# Altium project Main_card.PrjPcb
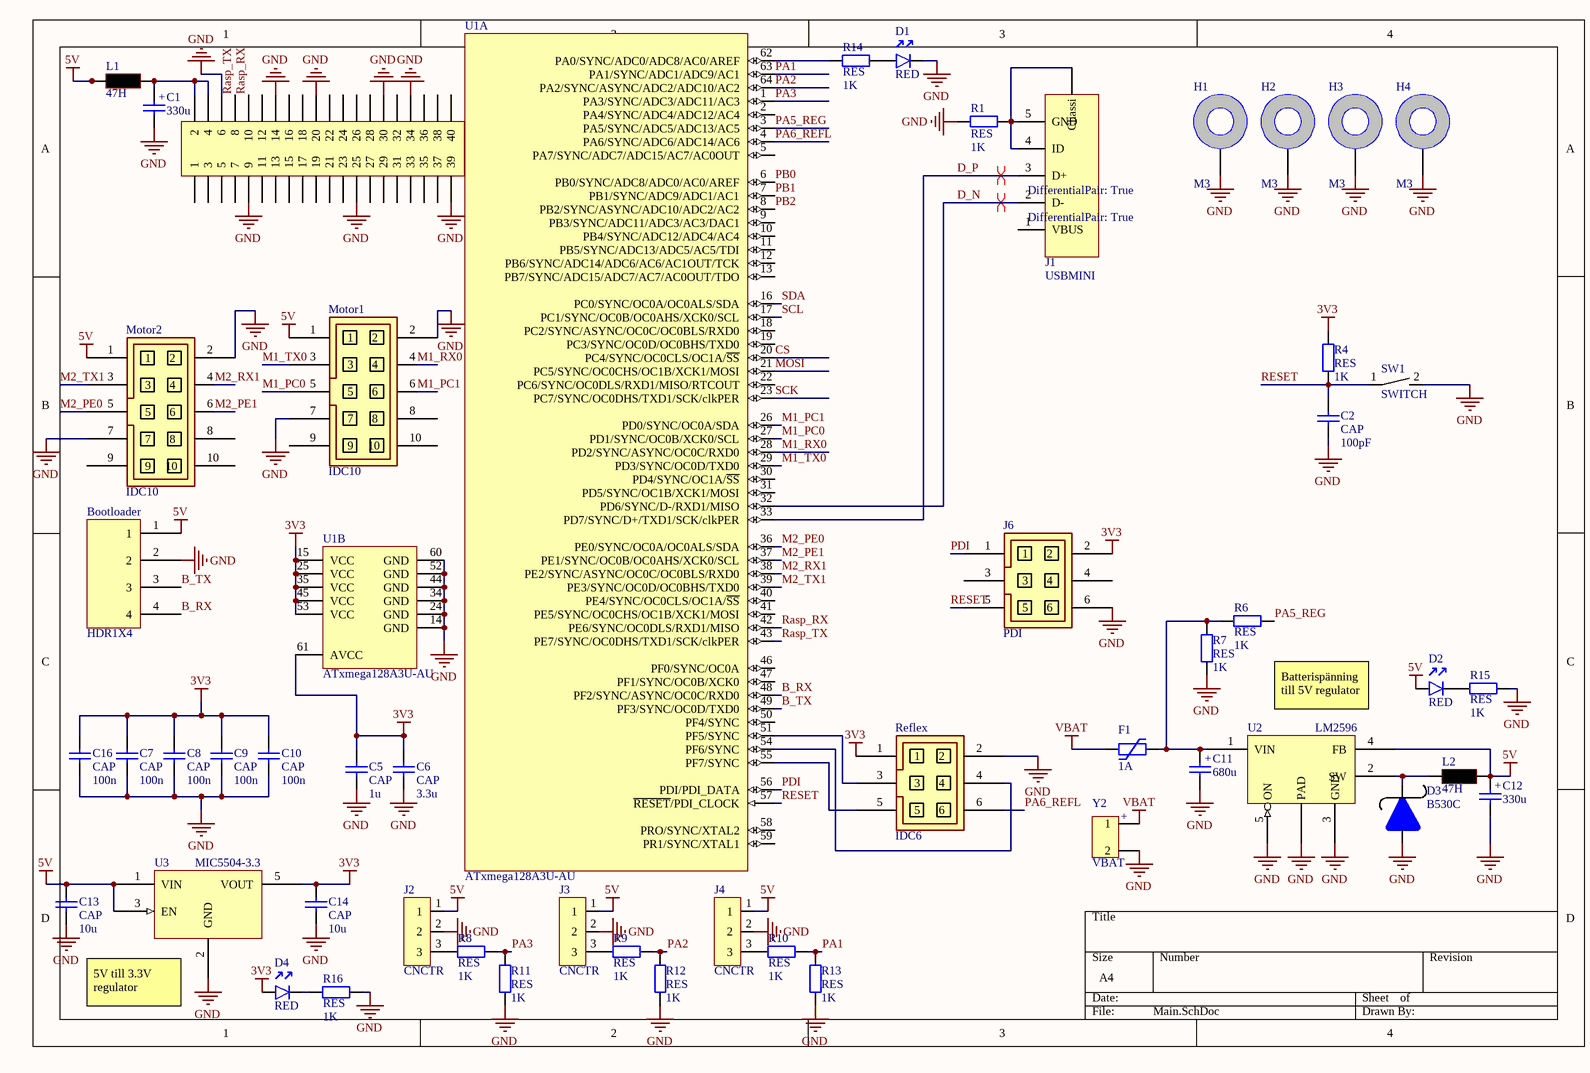
[diagram p0: Main.SchDoc]
2 sheets, 68 parts. Net scope: global (net labels, ports and power ports of the same name join across sheets).
Board file: Main_card.PcbDoc
Sheets:
  Main.SchDoc
  Display.SchDoc

## Sheet Main.SchDoc
size A4

### Parts
Bootloader  HDR1X4  [HEADER_1X4]
C1  330u  [CAP_FAT]
C2  CAP  value 100pF  [CAPC1608X08M]
C5  CAP  value 1u  [CAPC2012X11M]
C6  CAP  value 3.3u  [CAPC2012X11M]
C7  CAP  value 100n  [CAPC1608X08M]
C8  CAP  value 100n  [CAPC1608X08M]
C9  CAP  value 100n  [CAPC1608X08M]
C10  CAP  value 100n  [CAPC1608X08M]
C11  680u  [CAP_FAT]
C12  330u  [CAP_FAT]
C13  CAP  value 10u  [CAPC2012X11M]
C14  CAP  value 10u  [CAPC2012X11M]
C16  CAP  value 100n  [CAPC1608X08M]
D1  RED  [RESC1608X06M]
D2  RED  [RESC1608X06M]
D3  B530C  [Diode_B530C]
D4  RED  [RESC1608X06M]
F1  value 1A  [RESC3216X07M]  (hidden comment: POLYFUSE)
H1  M3  [MOUNT_M3]
H2  M3  [MOUNT_M3]
H3  M3  [MOUNT_M3]
H4  M3  [MOUNT_M3]
J1  USBMINI  [MINI_USB]
J2  CNCTR  [CNCTR_1X3]
J3  CNCTR  [CNCTR_1X3]
J4  CNCTR  [CNCTR_1X3]
J6  PDI  [IDC6]
L1  47H  [DR127]
L2  47H  [DR127]
Motor1  IDC10  [IDC10]
Motor2  IDC10  [IDC10]
R1  RES  value 1K  [RESC1608X06M]
R4  RES  value 1K  [RESC1608X06M]
R6  RES  value 1K  [RESC1608X06M]
R7  RES  value 1K  [RESC1608X06M]
R8  RES  value 1K  [RESC1608X06M]
R9  RES  value 1K  [RESC1608X06M]
R10  RES  value 1K  [RESC1608X06M]
R11  RES  value 1K  [RESC1608X06M]
R12  RES  value 1K  [RESC1608X06M]
R13  RES  value 1K  [RESC1608X06M]
R14  RES  value 1K  [RESC1608X06M]
R15  RES  value 1K  [RESC1608X06M]
R16  RES  value 1K  [RESC1608X06M]
Raspberry_Pi  Header 20X2  [HDR2X20]
Reflex  IDC6  [IDC6]
SW1  SWITCH  [Switch_pad]
U1  ATxmega128A3U-AU  [64A_N]  (parts A,B of 2)
U2  LM2596  [TO263]
U3  MIC5504-3.3  [SOT23-5]
Y2  VBAT  [BAT_CNCTR]

### Nets
3V3: C5.2 C6.2 C7.2 C8.2 C9.2 C10.2 C14.2 C16.2 D4.1(A1) J6.2 R4.2 Reflex.1 U1.15(VCC) U1.25(VCC) U1.35(VCC) U1.45(VCC) U1.53(VCC) U1.61(AVCC) U3.5(VOUT)
5V: Bootloader.1 C12.2 C13.2 D2.1(A1) J2.1 J3.1 J4.1 L1.1 L2.2 Motor1.1 Motor2.1 U2.4(FB) U3.1(VIN) U3.3(EN)
GND: Bootloader.2 C1.1 C2.1 C5.1 C6.1 C7.1 C8.1 C9.1 C10.1 C11.1 C12.1 C13.1 C14.1 C16.1 D1.2(K) D3.1 H1.1 H2.1 H3.1 H4.1 J2.2 J3.2 J4.2 J6.6 Motor1.2 Motor1.7 Motor2.2 Motor2.7 R1.1 R7.2 R11.1 R12.1 R13.1 R15.1 R16.1 Raspberry_Pi.6 Raspberry_Pi.9 Raspberry_Pi.14 Raspberry_Pi.20 Raspberry_Pi.25 Raspberry_Pi.30 Raspberry_Pi.34 Raspberry_Pi.39 Reflex.2 SW1.2 U1.14(GND) U1.24(GND) U1.34(GND) U1.44(GND) U1.52(GND) U1.60(GND) U2.3(GND) U2.5(ON) U2.PAD U3.2(GND) Y2.2
VBAT: F1.1 Y2.1
B_RX: Bootloader.4 U1.48(PF2/SYNC/ASYNC/OC0C/RXD0)
B_TX: Bootloader.3 U1.49(PF3/SYNC/OC0D/TXD0)
CS: U1.20(PC4/SYNC/OC0CLS/OC1A/~{SS})
D_N: J1.2(D-) U1.32(PD6/SYNC/D-/RXD1/MISO)
D_P: J1.3(D+) U1.33(PD7/SYNC/D+/TXD1/SCK/clkPER)
M1_PC0: Motor1.5 U1.27(PD1/SYNC/OC0B/XCK0/SCL)
M1_PC1: Motor1.6 U1.26(PD0/SYNC/OC0A/SDA)
M1_RX0: Motor1.4 U1.28(PD2/SYNC/ASYNC/OC0C/RXD0)
M1_TX0: Motor1.3 U1.29(PD3/SYNC/OC0D/TXD0)
M2_PE0: Motor2.5 U1.36(PE0/SYNC/OC0A/OC0ALS/SDA)
M2_PE1: Motor2.6 U1.37(PE1/SYNC/OC0B/OC0AHS/XCK0/SCL)
M2_RX1: Motor2.4 U1.38(PE2/SYNC/ASYNC/OC0C/OC0BLS/RXD0)
M2_TX1: Motor2.3 U1.39(PE3/SYNC/OC0D/OC0BHS/TXD0)
MOSI: U1.21(PC5/SYNC/OC0CHS/OC1B/XCK1/MOSI)
PA1: R10.1 R13.2 U1.63(PA1/SYNC/ADC1/ADC9/AC1)
PA2: R9.1 R12.2 U1.64(PA2/SYNC/ASYNC/ADC2/ADC10/AC2)
PA3: R8.1 R11.2 U1.1(PA3/SYNC/ADC3/ADC11/AC3)
PA5_REG: R6.1 U1.3(PA5/SYNC/ADC5/ADC13/AC5)
PA6_REFL: Reflex.6 U1.4(PA6/SYNC/ADC6/ADC14/AC6)
PB0: U1.6(PB0/SYNC/ADC8/ADC0/AC0/AREF)
PB1: U1.7(PB1/SYNC/ADC9/ADC1/AC1)
PB2: U1.8(PB2/SYNC/ASYNC/ADC10/ADC2/AC2)
PDI: J6.1 U1.56(PDI/PDI_DATA)
Rasp_RX: Raspberry_Pi.10 U1.42(PE6/SYNC/OC0DLS/RXD1/MISO)
Rasp_TX: Raspberry_Pi.8 U1.43(PE7/SYNC/OC0DHS/TXD1/SCK/clkPER)
RESET: C2.2 J6.5 R4.1 SW1.1 U1.57(~{RESET}/PDI_CLOCK)
SCK: U1.23(PC7/SYNC/OC0DHS/TXD1/SCK/clkPER)
SCL: U1.17(PC1/SYNC/OC0B/OC0AHS/XCK0/SCL)
SDA: U1.16(PC0/SYNC/OC0A/OC0ALS/SDA)
NetC1_2: C1.2 L1.2 Raspberry_Pi.2 Raspberry_Pi.4
NetC11_2: C11.2 F1.2 R6.2 R7.1 U2.1(VIN)
NetD1_1: D1.1(A1) R14.2
NetD2_2: D2.2(K) R15.2
NetD3_2: D3.2 L2.1 U2.2(SW)
NetD4_2: D4.2(K) R16.2
NetJ1_4: J1.4(ID) J1.5(GND) J1.C(Chassi) R1.2
NetJ2_3: J2.3 R8.2
NetJ3_3: J3.3 R9.2
NetJ4_3: J4.3 R10.2
NetR14_1: R14.1 U1.62(PA0/SYNC/ADC0/ADC8/AC0/AREF)
NetReflex_3: Reflex.3 U1.51(PF5/SYNC)
NetReflex_4: Reflex.4 U1.54(PF6/SYNC)
NetReflex_5: Reflex.5 U1.55(PF7/SYNC)

Not connected (* = marked no-connect by the designer): J1 1(VBUS); J6 3 4; Motor1 8 9 10; Motor2 8 9 10; Raspberry_Pi 1 3 5 7 11 12 13 15 16 17 18 19 21 22 23 24 26 27 28 29 31 32 33 35 36 37 38 40; U1 2(PA4/SYNC/ADC4/ADC12/AC4) 5(PA7/SYNC/ADC7/ADC15/AC7/AC0OUT) 9(PB3/SYNC/ADC11/ADC3/AC3/DAC1) 10(PB4/SYNC/ADC12/ADC4/AC4) 11(PB5/SYNC/ADC13/ADC5/AC5/TDI) 12(PB6/SYNC/ADC14/ADC6/AC6/AC1OUT/TCK) 13(PB7/SYNC/ADC15/ADC7/AC7/AC0OUT/TDO) 18(PC2/SYNC/ASYNC/OC0C/OC0BLS/RXD0) 19(PC3/SYNC/OC0D/OC0BHS/TXD0) 22(PC6/SYNC/OC0DLS/RXD1/MISO/RTCOUT) 30(PD4/SYNC/OC1A/~{SS}) 31(PD5/SYNC/OC1B/XCK1/MOSI) 40(PE4/SYNC/OC0CLS/OC1A/~{SS}) 41(PE5/SYNC/OC0CHS/OC1B/XCK1/MOSI) 46(PF0/SYNC/OC0A) 47(PF1/SYNC/OC0B/XCK0) 50(PF4/SYNC) 58(PRO/SYNC/XTAL2) 59(PR1/SYNC/XTAL1)

### Layout directives
differential pair: D_N, D_P

### Notes on the sheet
- Batterispänning till 5V regulator
- (near U3) 5V till 3.3V regulator
- (in symbol BAT_CNCTR) +
- (in symbol POLCAP) +

### Library data of the parts
Bootloader = HDR1X4: 4pin header
C1 C11 C12 = POLCAP
C2 C5-C10 C13 C14 C16 = CAP: Capacitor; Published: 8-Jun-2000; LatestRevisionDate: 17-Jul-2002; LatestRevisionNote: Re-released for DXP Platform.; PackageReference: RB7.6-15; Publisher: Altium Limited; PackageDescription: Polarized Capacitor (Radial); 2 Leads
D1 D2 D4 = LED
D3 = Diode_B530C
H1-H4 = MOUNT_M3
J1 = MINI_USB
J2-J4 = Connector: 3pin connector
J6 Reflex = IDC6: 6pin IDC connector
L1 L2 = DR127
Motor1 Motor2 = IDC10: 10pin IDC connector
R1 R4 R6-R16 = RES: Resistor; Published: 8-Jun-2000; LatestRevisionDate: 17-Jul-2002; LatestRevisionNote: Re-released for DXP Platform.; PackageReference: AXIAL-0.4; Publisher: Altium Limited; PackageDescription: Axial Device, Thru-Hole; 2 Leads; 0.4 in Pin Spacing
Raspberry_Pi = Header 20X2: Header, 20-Pin, Dual row; LatestRevisionDate: 17-Jul-2002; LatestRevisionNote: Re-released for DXP Platform.; Publisher: Altium Limited
U1 = ATxmega128A3U-AU: 8/16-bit AVR XMEGA A4 Microcontroller, 1.6-3.6V, 32MHz, 128K + 8KB Flash, 2K EEPROM, 8K SRAM, 64-pin TQFP, Industrial Grade (-40°C to 85°C); DatasheetVersion: revB, Dec-2011; PackageVersion: revC, Oct-2010; PackageReference: 64A; PackageDescription: 64-Pin Plastic Thin Profile Quad Flat Pack, 14 x 14 x 1.0 mm Body, 0.8 mm Pitch (TQFP); Code_JEDEC: MS-026-AEB; ComponentLink1Description: Manufacturer URL; ComponentLink1URL: http://www.atmel.com/; ComponentLink2Description: ATxmega64A3U/128A3U/192A3U/256A3U Datasheet; ComponentLink2URL: http://www.atmel.com/dyn/resources/prod_documents/doc8386.pdf
Y2 = BAT_CNCTR: 2-pin batteri kontakt
F1 = POLYFUSE: Published: 8-Jun-2000; LatestRevisionDate: 17-Jul-2002; LatestRevisionNote: Re-released for DXP Platform.; PackageReference: AXIAL-0.4; Publisher: Altium Limited; PackageDescription: Axial Device, Thru-Hole; 2 Leads; 0.4 in Pin Spacing

## Sheet Display.SchDoc
size A4
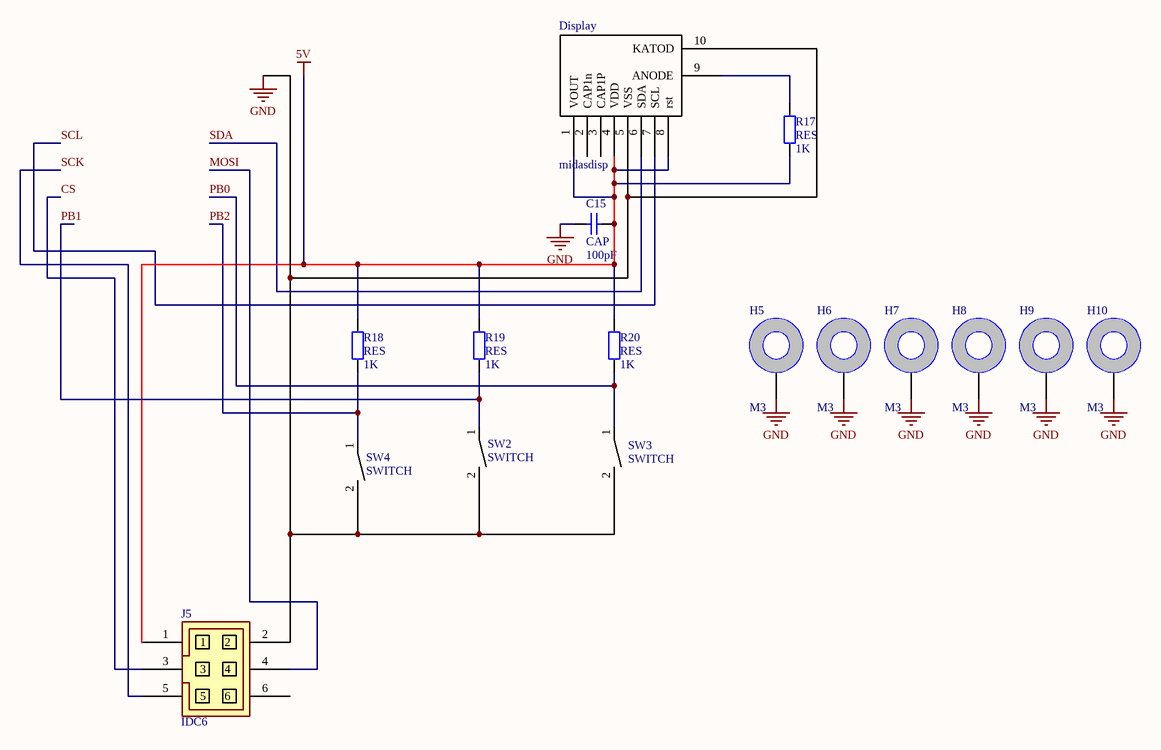
[diagram p1: Display.SchDoc]

### Parts
C15  CAP  value 100pF  [CAPC1608X08M]
Display  midasdisp  [Display]
H5  M3  [MOUNT_M3]
H6  M3  [MOUNT_M3]
H7  M3  [MOUNT_M3]
H8  M3  [MOUNT_M3]
H9  M3  [MOUNT_M3]
H10  M3  [MOUNT_M3]
J5  IDC6  [IDC6]
R17  RES  value 1K  [RESC1608X06M]
R18  RES  value 1K  [RESC1608X06M]
R19  RES  value 1K  [RESC1608X06M]
R20  RES  value 1K  [RESC1608X06M]
SW2  SWITCH  [Switch_pad]
SW3  SWITCH  [Switch_pad]
SW4  SWITCH  [Switch_pad]

### Nets
5V: C15.2 Display.1(VOUT) Display.4(VDD) Display.8(rst) J5.1 R17.1 R18.2 R19.2 R20.2
GND: C15.1 Display.5(VSS) Display.10(KATOD) H5.1 H6.1 H7.1 H8.1 H9.1 H10.1 J5.2 SW2.2 SW3.2 SW4.2
CS: J5.3
MOSI: J5.4
PB0: R20.1 SW3.1
PB1: R19.1 SW2.1
PB2: R18.1 SW4.1
SCK: J5.5
SCL: Display.7(SCL)
SDA: Display.6(SDA)
NetDisplay_9: Display.9(ANODE) R17.2

Not connected (* = marked no-connect by the designer): Display 2(CAP1n) 3(CAP1P); J5 6

### Library data of the parts
C15 = CAP: Capacitor; Published: 8-Jun-2000; LatestRevisionDate: 17-Jul-2002; LatestRevisionNote: Re-released for DXP Platform.; PackageReference: RB7.6-15; Publisher: Altium Limited; PackageDescription: Polarized Capacitor (Radial); 2 Leads
H5-H10 = MOUNT_M3
J5 = IDC6: 6pin IDC connector
R17-R20 = RES: Resistor; Published: 8-Jun-2000; LatestRevisionDate: 17-Jul-2002; LatestRevisionNote: Re-released for DXP Platform.; PackageReference: AXIAL-0.4; Publisher: Altium Limited; PackageDescription: Axial Device, Thru-Hole; 2 Leads; 0.4 in Pin Spacing

## Nets that join several sheets
5V: Main (14 pins), Display (9 pins)
GND: Main (56 pins), Display (13 pins)
CS: Main (U1.20), Display (J5.3)
MOSI: Main (U1.21), Display (J5.4)
PB0: Main (U1.6), Display (R20.1 SW3.1)
PB1: Main (U1.7), Display (R19.1 SW2.1)
PB2: Main (U1.8), Display (R18.1 SW4.1)
SCK: Main (U1.23), Display (J5.5)
SCL: Main (U1.17), Display (Display.7)
SDA: Main (U1.16), Display (Display.6)